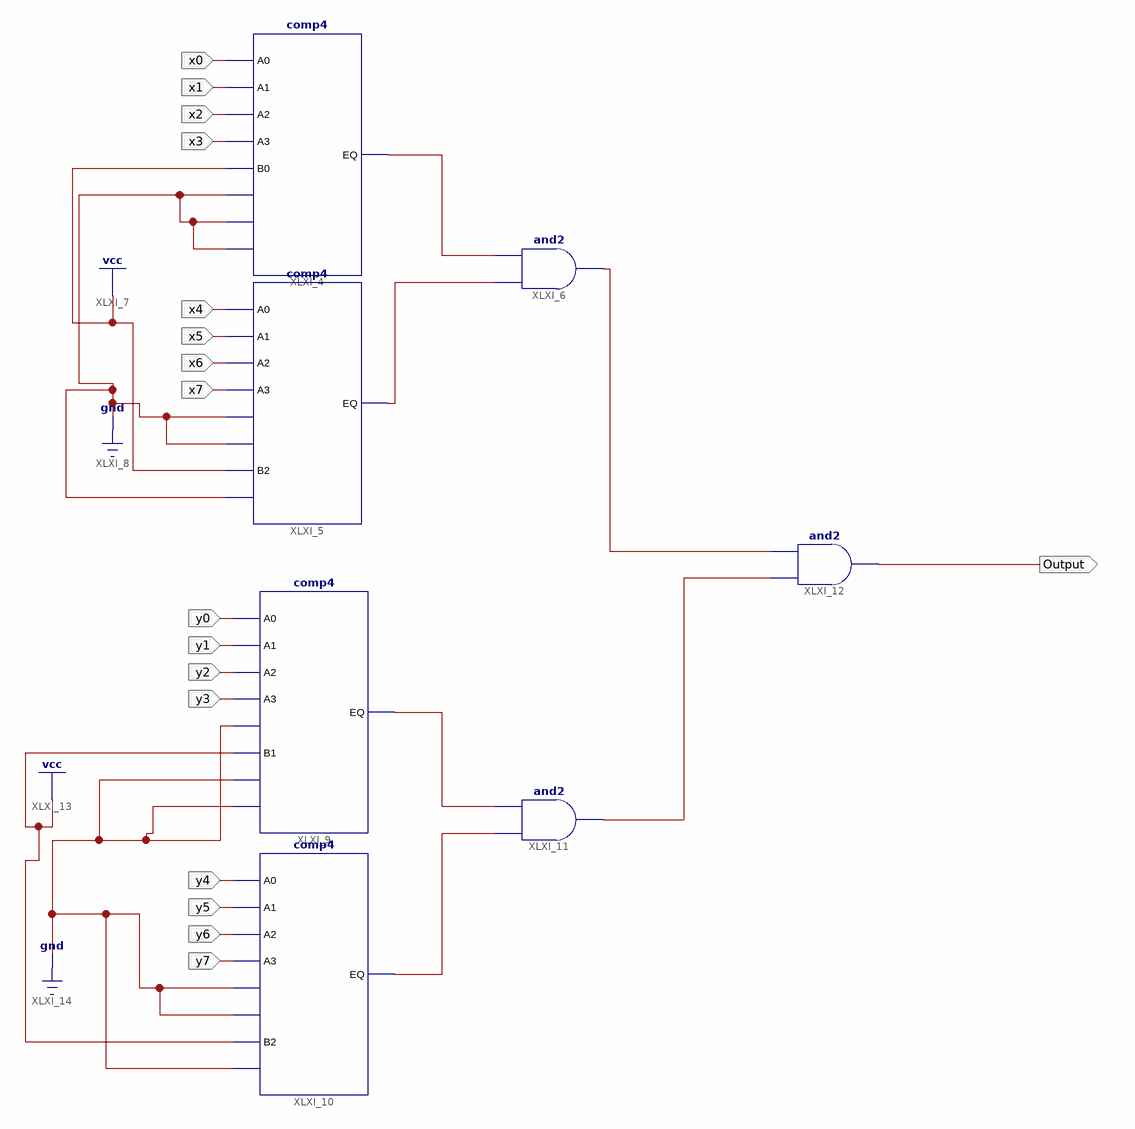
[diagram p0: schematic sheet 1]
// Xilinx ISE schematic schemat_2znaki.sch (artix7) as structural Verilog: 7 symbols, 17 ports
module schemat_2znaki (
  input  x0,
  input  x1,
  input  x2,
  input  x3,
  input  x4,
  input  x5,
  input  x6,
  input  x7,
  input  y0,
  input  y1,
  input  y2,
  input  y3,
  input  y4,
  input  y5,
  input  y6,
  input  y7,
  output Output
);

  wire XLXN_8, XLXN_10, XLXN_24, XLXN_25, XLXN_26, XLXN_28;

  comp4 XLXI_4 (.A0(x0), .A1(x1), .A2(x2), .A3(x3), .B0(1'b1), .B1(1'b0), .B2(1'b0), .B3(1'b0), .EQ(XLXN_8));
  comp4 XLXI_5 (.A0(x4), .A1(x5), .A2(x6), .A3(x7), .B0(1'b0), .B1(1'b0), .B2(1'b1), .B3(1'b0), .EQ(XLXN_10));
  and XLXI_6 (XLXN_28, XLXN_10, XLXN_8);
  comp4 XLXI_9 (.A0(y0), .A1(y1), .A2(y2), .A3(y3), .B0(1'b0), .B1(1'b1), .B2(1'b0), .B3(1'b0), .EQ(XLXN_24));
  comp4 XLXI_10 (.A0(y4), .A1(y5), .A2(y6), .A3(y7), .B0(1'b0), .B1(1'b0), .B2(1'b1), .B3(1'b0), .EQ(XLXN_25));
  and XLXI_11 (XLXN_26, XLXN_25, XLXN_24);
  and XLXI_12 (Output, XLXN_26, XLXN_28);
endmodule
